# Altium project MU-RK3576J-MB.PrjPCB (part 4 of 13)

## Sheet CPU.SchDoc
size 420 x 297 mm; SheetNumber: 9; SheetTotal: 32; DocumentTypeShort: Э3; DocumentInvertoryNumber: ㅤ
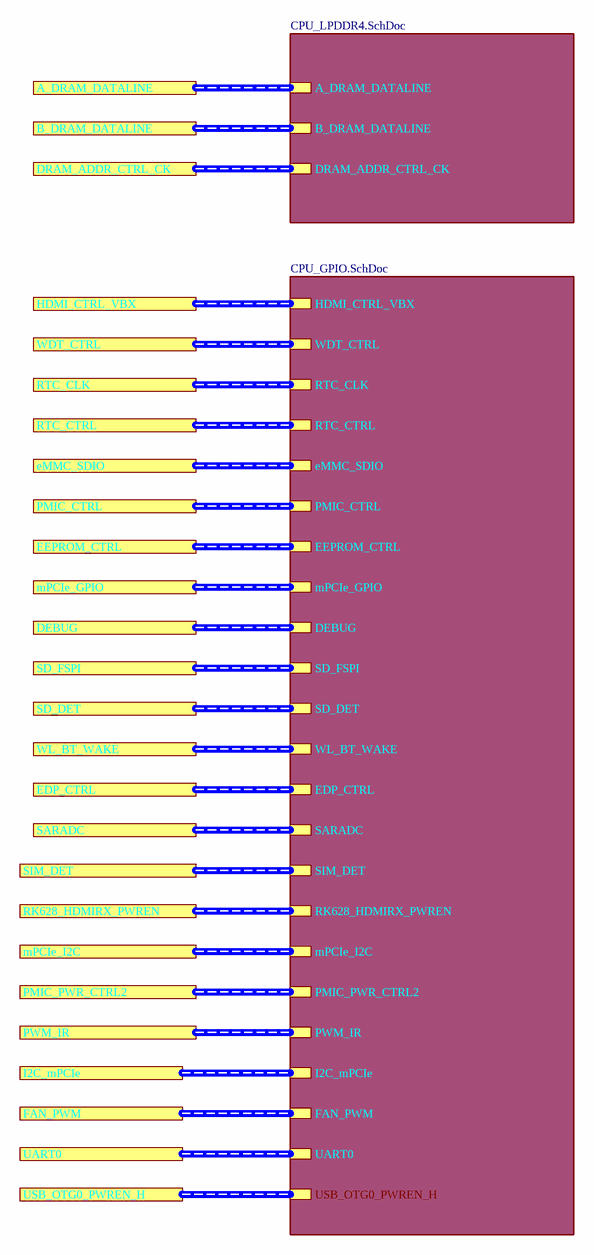
[diagram p8: CPU.SchDoc]

### Sub-sheets
CPU_GPIO = CPU_GPIO.SchDoc: HDMI_CTRL_VBX (harness HDMI_CTRL_VBX), WDT_CTRL (harness WDT_CTRL), RTC_CLK (harness RTC_CLK), RTC_CTRL (harness RTC_CTRL), eMMC_SDIO (harness eMMC_SDIO), PMIC_CTRL (harness PMIC_CTRL), EEPROM_CTRL (harness EEPROM_CTRL), SD_FSPI (harness SD_FSPI), SD_DET (harness SD_DET), WL_BT_WAKE (harness WL_BT_WAKE), EDP_CTRL (harness EDP_CTRL), SARADC (harness SARADC), mPCIe_GPIO (harness mPCIe_GPIO), SIM_DET (harness SIM_DET), mPCIe_I2C (harness mPCIe_I2C), RK628_HDMIRX_PWREN (harness RK628_HDMIRX_PWREN), PMIC_PWR_CTRL2 (harness PMIC_PWR_CTRL2), PWM_IR (harness PWM0_IR), I2C_mPCIe (harness I2C_mPCIe), DEBUG (harness DEBUG), FAN_PWM (harness FAN_PWM), UART0 (harness UART0), USB_OTG0_PWREN_H (harness USB_OTG0_PWREN_H)
CPU_LPDDR4 = CPU_LPDDR4.SchDoc: A_DRAM_DATALINE (harness A_DRAM_DATALINE), B_DRAM_DATALINE (harness B_DRAM_DATALINE), DRAM_ADDR_CTRL_CK (harness DRAM_ADDR_CTRL_CK)

### Ports
A_DRAM_DATALINE, B_DRAM_DATALINE, DEBUG, DRAM_ADDR_CTRL_CK, EDP_CTRL, EEPROM_CTRL, eMMC_SDIO, FAN_PWM, HDMI_CTRL_VBX, I2C_mPCIe, mPCIe_GPIO, mPCIe_I2C, PMIC_CTRL, PMIC_PWR_CTRL2, PWM_IR, RK628_HDMIRX_PWREN, RTC_CLK, RTC_CTRL, SARADC, SD_DET, SD_FSPI, SIM_DET, UART0, USB_OTG0_PWREN_H, WDT_CTRL, WL_BT_WAKE

### Buses and harness runs
harness port A_DRAM_DATALINE = sheet CPU_LPDDR4/A_DRAM_DATALINE
harness port B_DRAM_DATALINE = sheet CPU_LPDDR4/B_DRAM_DATALINE
harness port DEBUG = sheet CPU_GPIO/DEBUG
harness port DRAM_ADDR_CTRL_CK = sheet CPU_LPDDR4/DRAM_ADDR_CTRL_CK
harness port EDP_CTRL = sheet CPU_GPIO/EDP_CTRL
harness port EEPROM_CTRL = sheet CPU_GPIO/EEPROM_CTRL
harness port eMMC_SDIO = sheet CPU_GPIO/eMMC_SDIO
harness port FAN_PWM = sheet CPU_GPIO/FAN_PWM
harness port HDMI_CTRL_VBX = sheet CPU_GPIO/HDMI_CTRL_VBX
harness port I2C_mPCIe = sheet CPU_GPIO/I2C_mPCIe
harness port mPCIe_GPIO = sheet CPU_GPIO/mPCIe_GPIO
harness port mPCIe_I2C = sheet CPU_GPIO/mPCIe_I2C
harness port PMIC_CTRL = sheet CPU_GPIO/PMIC_CTRL
harness port PMIC_PWR_CTRL2 = sheet CPU_GPIO/PMIC_PWR_CTRL2
harness port PWM_IR = sheet CPU_GPIO/PWM_IR
harness port RK628_HDMIRX_PWREN = sheet CPU_GPIO/RK628_HDMIRX_PWREN
harness port RTC_CLK = sheet CPU_GPIO/RTC_CLK
harness port RTC_CTRL = sheet CPU_GPIO/RTC_CTRL
harness port SARADC = sheet CPU_GPIO/SARADC
harness port SD_DET = sheet CPU_GPIO/SD_DET
harness port SD_FSPI = sheet CPU_GPIO/SD_FSPI
harness port SIM_DET = sheet CPU_GPIO/SIM_DET
harness port UART0 = sheet CPU_GPIO/UART0
harness port USB_OTG0_PWREN_H = sheet CPU_GPIO/USB_OTG0_PWREN_H
harness port WDT_CTRL = sheet CPU_GPIO/WDT_CTRL
harness port WL_BT_WAKE = sheet CPU_GPIO/WL_BT_WAKE

### Notes on the sheet
- Подп. и дата
- Инв. № дубл.
- Взам. инв. №
- Инв. № подл.
- Изм.
- Лист
- № докум.
- Подп.
- Дата
- Копировал
- Формат А3

## Sheet CPU_LPDDR4.SchDoc
size 420 x 297 mm; Title1str: Модуль; Title2str: ATB-LW-USB-GateWay; Mass: ---; Letter1Column: О; Letter2Column: {L}; DocumentType1str: {Документ}; DocumentType2str: {Документ}; SpravNomer: {Справ. №}; PageSetup: Record=PageOptions|CenterHorizontal=False|CenterVertical=False|PrintScale=0.95|XCorrection=0.00|YCorrection=0.00|PrintKind=1|BorderSize=5000000|LeftOffset=0|BottomOffset=0|Orientation=1|PaperLength=1000|PaperWidth=1000|Scale=100|PaperSource=15|PrintQuality=600|MediaType=1|DitherType=10|PaperKind=A4|PrintScaleMode=1; Scale: 1:1; DocumentType: Схема электрическая принципиальная; SheetNumber: 10; SheetTotal: 32; DocumentTypeShort: Э3; DocumentInvertoryNumber: ㅤ
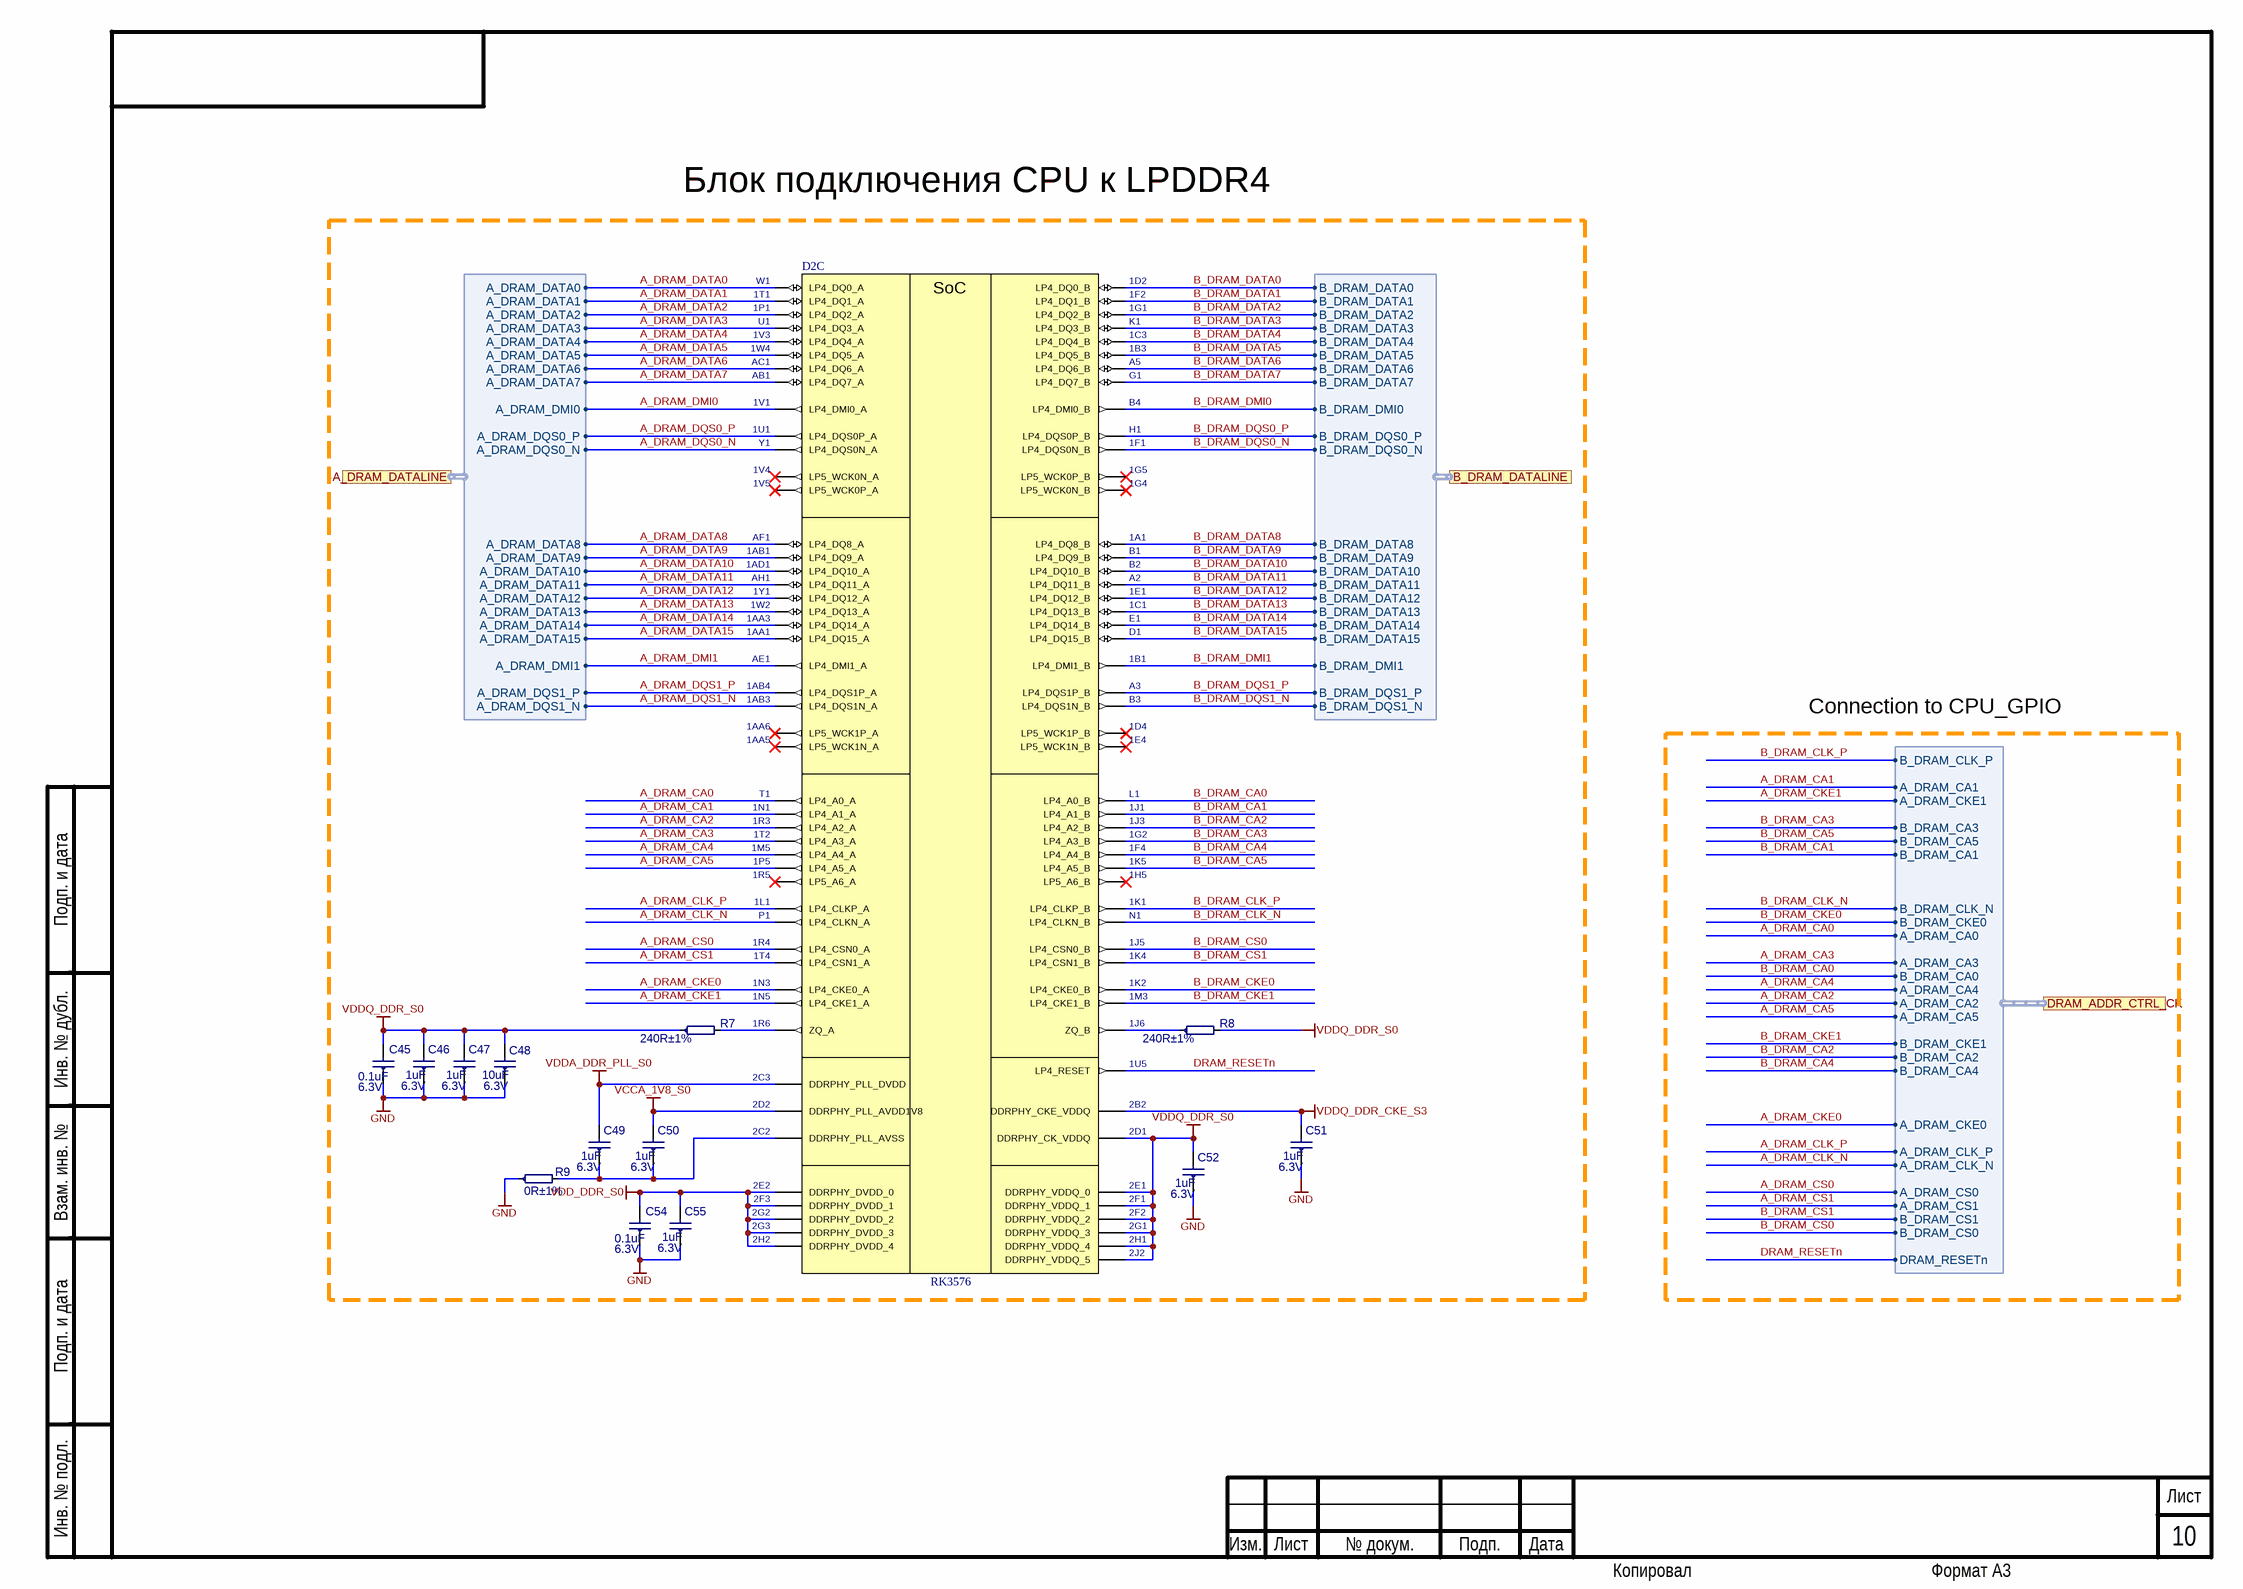
[diagram p9: CPU_LPDDR4.SchDoc]

### Parts
C45  0.1uF  Voltage: 6.3V  [C0201]
C46  1uF  Voltage: 6.3V  [C0201]
C47  1uF  Voltage: 6.3V  [C0201]
C48  10uF  Voltage: 6.3V  [C0402]
C49  1uF  Voltage: 6.3V  [C0201]
C50  1uF  Voltage: 6.3V  [C0201]
C51  1uF  Voltage: 6.3V  [C0201]
C52  1uF  Voltage: 6.3V  [C0201]
C54  0.1uF  Voltage: 6.3V  [C0201]
C55  1uF  Voltage: 6.3V  [C0201]
D2  RK3576  [BGAFCCSP698L]  (part C of 7)
R7  240R±1%  [R0201]
R8  240R±1%  [R0201]
R9  0R±1%  [R0402]

### Ports
A_DRAM_DATALINE (harness A_DRAM_DATALINE), B_DRAM_DATALINE (harness B_DRAM_DATALINE), DRAM_ADDR_CTRL_CK (harness DRAM_ADDR_CTRL_CK)

### Harnesses
A_DRAM_DATALINE: A_DRAM_DATA0, A_DRAM_DATA1, A_DRAM_DATA2, A_DRAM_DATA3, A_DRAM_DATA4, A_DRAM_DATA5, A_DRAM_DATA6, A_DRAM_DATA7, A_DRAM_DATA8, A_DRAM_DATA9, A_DRAM_DATA10, A_DRAM_DATA11, A_DRAM_DATA12, A_DRAM_DATA13, A_DRAM_DATA15, A_DRAM_DATA14, A_DRAM_DMI0, A_DRAM_DMI1, A_DRAM_DQS0_P, A_DRAM_DQS0_N, A_DRAM_DQS1_P, A_DRAM_DQS1_N
B_DRAM_DATALINE: B_DRAM_DATA0, B_DRAM_DATA1, B_DRAM_DATA2, B_DRAM_DATA3, B_DRAM_DATA4, B_DRAM_DATA5, B_DRAM_DATA6, B_DRAM_DATA7, B_DRAM_DATA9, B_DRAM_DATA10, B_DRAM_DATA11, B_DRAM_DATA12, B_DRAM_DATA13, B_DRAM_DATA15, B_DRAM_DATA14, B_DRAM_DMI1, B_DRAM_DMI0, B_DRAM_DQS0_P, B_DRAM_DQS0_N, B_DRAM_DQS1_N, B_DRAM_DQS1_P, B_DRAM_DATA8
DRAM_ADDR_CTRL_CK: A_DRAM_CA5, B_DRAM_CKE1, B_DRAM_CA2, A_DRAM_CLK_P, B_DRAM_CLK_N, A_DRAM_CA3, A_DRAM_CKE0, B_DRAM_CA0, B_DRAM_CKE0, DRAM_RESETn, A_DRAM_CA4, B_DRAM_CA1, A_DRAM_CKE1, B_DRAM_CA3, B_DRAM_CLK_P, A_DRAM_CLK_N, B_DRAM_CA5, A_DRAM_CA0, A_DRAM_CA1, A_DRAM_CA2, B_DRAM_CA4, A_DRAM_CS0, A_DRAM_CS1, B_DRAM_CS1, B_DRAM_CS0

### Nets
GND: C45.1 C46.1 C47.1 C48.1 C51.1 C52.1 C54.1 C55.1 R9.1
VCCA_1V8_S0: C50.2 D2.2D2(DDRPHY_PLL_AVDD1V8)
VDD_DDR_S0: C54.2 C55.2 D2.2E2(DDRPHY_DVDD_0) D2.2F3(DDRPHY_DVDD_1) D2.2G2(DDRPHY_DVDD_2) D2.2G3(DDRPHY_DVDD_3) D2.2H2(DDRPHY_DVDD_4)
VDDA_DDR_PLL_S0: C49.2 D2.2C3(DDRPHY_PLL_DVDD)
VDDQ_DDR_CKE_S3: C51.2 D2.2B2(DDRPHY_CKE_VDDQ)
VDDQ_DDR_S0: C45.2 C46.2 C47.2 C48.2 C52.2 D2.2D1(DDRPHY_CK_VDDQ) D2.2E1(DDRPHY_VDDQ_0) D2.2F1(DDRPHY_VDDQ_1) D2.2F2(DDRPHY_VDDQ_2) D2.2G1(DDRPHY_VDDQ_3) D2.2H1(DDRPHY_VDDQ_4) D2.2J2(DDRPHY_VDDQ_5) R7.1 R8.2
A_DRAM_CA0: D2.T1(LP4_A0_A) ; port DRAM_ADDR_CTRL_CK.A_DRAM_CA0
A_DRAM_CA1: D2.1N1(LP4_A1_A) ; port DRAM_ADDR_CTRL_CK.A_DRAM_CA1
A_DRAM_CA2: D2.1R3(LP4_A2_A) ; port DRAM_ADDR_CTRL_CK.A_DRAM_CA2
A_DRAM_CA3: D2.1T2(LP4_A3_A) ; port DRAM_ADDR_CTRL_CK.A_DRAM_CA3
A_DRAM_CA4: D2.1M5(LP4_A4_A) ; port DRAM_ADDR_CTRL_CK.A_DRAM_CA4
A_DRAM_CA5: D2.1P5(LP4_A5_A) ; port DRAM_ADDR_CTRL_CK.A_DRAM_CA5
A_DRAM_CKE0: D2.1N3(LP4_CKE0_A) ; port DRAM_ADDR_CTRL_CK.A_DRAM_CKE0
A_DRAM_CKE1: D2.1N5(LP4_CKE1_A) ; port DRAM_ADDR_CTRL_CK.A_DRAM_CKE1
A_DRAM_CLK_N: D2.P1(LP4_CLKN_A) ; port DRAM_ADDR_CTRL_CK.A_DRAM_CLK_N
A_DRAM_CLK_P: D2.1L1(LP4_CLKP_A) ; port DRAM_ADDR_CTRL_CK.A_DRAM_CLK_P
A_DRAM_CS0: D2.1R4(LP4_CSN0_A) ; port DRAM_ADDR_CTRL_CK.A_DRAM_CS0
A_DRAM_CS1: D2.1T4(LP4_CSN1_A) ; port DRAM_ADDR_CTRL_CK.A_DRAM_CS1
A_DRAM_DATA0: D2.W1(LP4_DQ0_A) ; port A_DRAM_DATALINE.A_DRAM_DATA0
A_DRAM_DATA1: D2.1T1(LP4_DQ1_A) ; port A_DRAM_DATALINE.A_DRAM_DATA1
A_DRAM_DATA2: D2.1P1(LP4_DQ2_A) ; port A_DRAM_DATALINE.A_DRAM_DATA2
A_DRAM_DATA3: D2.U1(LP4_DQ3_A) ; port A_DRAM_DATALINE.A_DRAM_DATA3
A_DRAM_DATA4: D2.1V3(LP4_DQ4_A) ; port A_DRAM_DATALINE.A_DRAM_DATA4
A_DRAM_DATA5: D2.1W4(LP4_DQ5_A) ; port A_DRAM_DATALINE.A_DRAM_DATA5
A_DRAM_DATA6: D2.AC1(LP4_DQ6_A) ; port A_DRAM_DATALINE.A_DRAM_DATA6
A_DRAM_DATA7: D2.AB1(LP4_DQ7_A) ; port A_DRAM_DATALINE.A_DRAM_DATA7
A_DRAM_DATA8: D2.AF1(LP4_DQ8_A) ; port A_DRAM_DATALINE.A_DRAM_DATA8
A_DRAM_DATA9: D2.1AB1(LP4_DQ9_A) ; port A_DRAM_DATALINE.A_DRAM_DATA9
A_DRAM_DATA10: D2.1AD1(LP4_DQ10_A) ; port A_DRAM_DATALINE.A_DRAM_DATA10
A_DRAM_DATA11: D2.AH1(LP4_DQ11_A) ; port A_DRAM_DATALINE.A_DRAM_DATA11
A_DRAM_DATA12: D2.1Y1(LP4_DQ12_A) ; port A_DRAM_DATALINE.A_DRAM_DATA12
A_DRAM_DATA13: D2.1W2(LP4_DQ13_A) ; port A_DRAM_DATALINE.A_DRAM_DATA13
A_DRAM_DATA14: D2.1AA3(LP4_DQ14_A) ; port A_DRAM_DATALINE.A_DRAM_DATA14
A_DRAM_DATA15: D2.1AA1(LP4_DQ15_A) ; port A_DRAM_DATALINE.A_DRAM_DATA15
A_DRAM_DMI0: D2.1V1(LP4_DMI0_A) ; port A_DRAM_DATALINE.A_DRAM_DMI0  [project net A_DRAM_DATALINE.A_DRAM_DMI0]
A_DRAM_DMI1: D2.AE1(LP4_DMI1_A) ; port A_DRAM_DATALINE.A_DRAM_DMI1  [project net A_DRAM_DATALINE.A_DRAM_DMI1]
A_DRAM_DQS0_N: D2.Y1(LP4_DQS0N_A) ; port A_DRAM_DATALINE.A_DRAM_DQS0_N  [project net A_DRAM_DATALINE.A_DRAM_DQS0_N]
A_DRAM_DQS0_P: D2.1U1(LP4_DQS0P_A) ; port A_DRAM_DATALINE.A_DRAM_DQS0_P  [project net A_DRAM_DATALINE.A_DRAM_DQS0_P]
A_DRAM_DQS1_N: D2.1AB3(LP4_DQS1N_A) ; port A_DRAM_DATALINE.A_DRAM_DQS1_N  [project net A_DRAM_DATALINE.A_DRAM_DQS1_N]
A_DRAM_DQS1_P: D2.1AB4(LP4_DQS1P_A) ; port A_DRAM_DATALINE.A_DRAM_DQS1_P  [project net A_DRAM_DATALINE.A_DRAM_DQS1_P]
B_DRAM_CA0: D2.L1(LP4_A0_B) ; port DRAM_ADDR_CTRL_CK.B_DRAM_CA0
B_DRAM_CA1: D2.1J1(LP4_A1_B) ; port DRAM_ADDR_CTRL_CK.B_DRAM_CA1
B_DRAM_CA2: D2.1J3(LP4_A2_B) ; port DRAM_ADDR_CTRL_CK.B_DRAM_CA2
B_DRAM_CA3: D2.1G2(LP4_A3_B) ; port DRAM_ADDR_CTRL_CK.B_DRAM_CA3
B_DRAM_CA4: D2.1F4(LP4_A4_B) ; port DRAM_ADDR_CTRL_CK.B_DRAM_CA4
B_DRAM_CA5: D2.1K5(LP4_A5_B) ; port DRAM_ADDR_CTRL_CK.B_DRAM_CA5
B_DRAM_CKE0: D2.1K2(LP4_CKE0_B) ; port DRAM_ADDR_CTRL_CK.B_DRAM_CKE0
B_DRAM_CKE1: D2.1M3(LP4_CKE1_B) ; port DRAM_ADDR_CTRL_CK.B_DRAM_CKE1
B_DRAM_CLK_N: D2.N1(LP4_CLKN_B) ; port DRAM_ADDR_CTRL_CK.B_DRAM_CLK_N
B_DRAM_CLK_P: D2.1K1(LP4_CLKP_B) ; port DRAM_ADDR_CTRL_CK.B_DRAM_CLK_P
B_DRAM_CS0: D2.1J5(LP4_CSN0_B) ; port DRAM_ADDR_CTRL_CK.B_DRAM_CS0
B_DRAM_CS1: D2.1K4(LP4_CSN1_B) ; port DRAM_ADDR_CTRL_CK.B_DRAM_CS1
B_DRAM_DATA0: D2.1D2(LP4_DQ0_B) ; port B_DRAM_DATALINE.B_DRAM_DATA0
B_DRAM_DATA1: D2.1F2(LP4_DQ1_B) ; port B_DRAM_DATALINE.B_DRAM_DATA1
B_DRAM_DATA2: D2.1G1(LP4_DQ2_B) ; port B_DRAM_DATALINE.B_DRAM_DATA2
B_DRAM_DATA3: D2.K1(LP4_DQ3_B) ; port B_DRAM_DATALINE.B_DRAM_DATA3
B_DRAM_DATA4: D2.1C3(LP4_DQ4_B) ; port B_DRAM_DATALINE.B_DRAM_DATA4
B_DRAM_DATA5: D2.1B3(LP4_DQ5_B) ; port B_DRAM_DATALINE.B_DRAM_DATA5
B_DRAM_DATA6: D2.A5(LP4_DQ6_B) ; port B_DRAM_DATALINE.B_DRAM_DATA6
B_DRAM_DATA7: D2.G1(LP4_DQ7_B) ; port B_DRAM_DATALINE.B_DRAM_DATA7
B_DRAM_DATA8: D2.1A1(LP4_DQ8_B) ; port B_DRAM_DATALINE.B_DRAM_DATA8
B_DRAM_DATA9: D2.B1(LP4_DQ9_B) ; port B_DRAM_DATALINE.B_DRAM_DATA9
B_DRAM_DATA10: D2.B2(LP4_DQ10_B) ; port B_DRAM_DATALINE.B_DRAM_DATA10
B_DRAM_DATA11: D2.A2(LP4_DQ11_B) ; port B_DRAM_DATALINE.B_DRAM_DATA11
B_DRAM_DATA12: D2.1E1(LP4_DQ12_B) ; port B_DRAM_DATALINE.B_DRAM_DATA12
B_DRAM_DATA13: D2.1C1(LP4_DQ13_B) ; port B_DRAM_DATALINE.B_DRAM_DATA13
B_DRAM_DATA14: D2.E1(LP4_DQ14_B) ; port B_DRAM_DATALINE.B_DRAM_DATA14
B_DRAM_DATA15: D2.D1(LP4_DQ15_B) ; port B_DRAM_DATALINE.B_DRAM_DATA15
B_DRAM_DMI0: D2.B4(LP4_DMI0_B) ; port B_DRAM_DATALINE.B_DRAM_DMI0  [project net B_DRAM_DATALINE.B_DRAM_DMI0]
B_DRAM_DMI1: D2.1B1(LP4_DMI1_B) ; port B_DRAM_DATALINE.B_DRAM_DMI1  [project net B_DRAM_DATALINE.B_DRAM_DMI1]
B_DRAM_DQS0_N: D2.1F1(LP4_DQS0N_B) ; port B_DRAM_DATALINE.B_DRAM_DQS0_N  [project net B_DRAM_DATALINE.B_DRAM_DQS0_N]
B_DRAM_DQS0_P: D2.H1(LP4_DQS0P_B) ; port B_DRAM_DATALINE.B_DRAM_DQS0_P  [project net B_DRAM_DATALINE.B_DRAM_DQS0_P]
B_DRAM_DQS1_N: D2.B3(LP4_DQS1N_B) ; port B_DRAM_DATALINE.B_DRAM_DQS1_N  [project net B_DRAM_DATALINE.B_DRAM_DQS1_N]
B_DRAM_DQS1_P: D2.A3(LP4_DQS1P_B) ; port B_DRAM_DATALINE.B_DRAM_DQS1_P  [project net B_DRAM_DATALINE.B_DRAM_DQS1_P]
DRAM_RESETn: D2.1U5(LP4_RESET) ; port DRAM_ADDR_CTRL_CK.DRAM_RESETn  [project net DRAM_ADDR_CTRL_CK.DRAM_RESETn]
NetC49_1: C49.1 C50.1 D2.2C2(DDRPHY_PLL_AVSS) R9.2
NetD2_1J6: D2.1J6(ZQ_B) R8.1
NetD2_1R6: D2.1R6(ZQ_A) R7.2

Not connected (* = marked no-connect by the designer): D2 1AA5(LP5_WCK1N_A)* 1AA6(LP5_WCK1P_A)* 1D4(LP5_WCK1P_B)* 1E4(LP5_WCK1N_B)* 1G4(LP5_WCK0N_B)* 1G5(LP5_WCK0P_B)* 1H5(LP5_A6_B)* 1R5(LP5_A6_A)* 1V4(LP5_WCK0N_A)* 1V5(LP5_WCK0P_A)*

### Notes on the sheet
- Блок подключения CPU к LPDDR4
- Connection to CPU_GPIO
- Подп. и дата
- Инв. № дубл.
- Взам. инв. №
- Инв. № подл.
- Изм.
- Лист
- № докум.
- Подп.
- Дата
- Копировал
- Формат А3
- (in symbol RK3576, part C) SoC

### Library data of the parts
C45 C54 = 0201-X5R-6.3V-0.1uF±10%: as C124 on sheet PWR_CPU; Case: C0201; Part Number: 0201-X5R-6.3V-0.1uF±10%; Value: 0.1uF; Temperature: -55°C~85°C; ComponentLink2Description: Link to datasheet; ComponentLink1Description: DATASHEET; ComponentLink2URL: https://www.terraelectronica.ru/product/1020032; ComponentLink1URL: Datasheets/capacitors/UPY-GPHC_X5R_4V-to-50V_27.pdf; Last changed: 27.10.2022
C46 C47 C49-C52 C55 = 0201-X5R-6.3V-1uF±20%: as C127-C129 on sheet PWR_CPU; Case: C0201; Part Number: 0201-X5R-6.3V-1uF±20%; Value: 1uF; Temperature: -55°C~85°C; ComponentLink2Description: Link to datasheet; ComponentLink1Description: DATASHEET; ComponentLink2URL: https://www.terraelectronica.ru/product/1209278; ComponentLink1URL: Datasheets/capacitors/GRM033R60J105MEA2-61A.pdf; Last changed: 27.10.2022
C48 = 0402-X5R-6.3V-10uF±20%: as C130 on sheet PWR_CPU; Case: C0402; Part Number: 0402-X5R-6.3V-10uF±20%; Value: 10uF; Temperature: -55°C~125°C; ComponentLink2Description: Link to datasheet; ComponentLink1Description: DATASHEET; ComponentLink2URL: https://ru.mouser.com/ProductDetail/YAGEO/CC0402MRX5R5BB106?qs=%2Fha2pyFadujQAk9rG2cgJj8l7IbODD3KVaDjvxAcKzu9LtlLnRlq6Q%3D%3D; ComponentLink1URL: Datasheets/capacitors/UPY-GPHC_X5R_4V-to-50V_27.pdf; Last changed: 27.10.2022
D2 = RK3576: as D2 on sheet PWR_CPU; Part Number: RK3576; Temperature: -40°C~85°C; Value: RK3576; ComponentLink1Description: DATASHEET; NameFromManufacturer: RK3576; ComponentLink1URL: https://wiki.friendlyelec.com/wiki/images/b/bf/Rockchip_RK3576_Datasheet_V1.5-20241216.pdf; Last changed: 06.01.2026
R7 R8 = 0201-0.05W-0R-100ppm-5%: *; Part Number: 0201-0.05W-240R-100ppm-5%; NameFromManufacturer: RC0201FR-07240RL; Manufacturer: Yageo; Place: *); Value: 240R; Tolerance: 1%; Check: False; Case: R0201; Temperature: -40°C~125°C; ComponentLink1Description: DATASHEET; ComponentLink1URL: https://www.digikey.com/en/products/detail/yageo/RC0201JR-070RL/1948898; Datasheet: Datasheets/resistors/PYu-RC_Group_51_RoHS_L_11.pdf+BB3:B271; Last changed: 27.10.2022
R9 = 0402-0.0625W-0R-100ppm±1%: as R29 on sheet PWR_CPU; Case: R0402; Part Number: 0402-0.0625W-0R-100ppm±1%; Tolerance: 1%; Temperature: -55°C~155°C; ComponentLink1Description: DATASHEET; ComponentLink1URL: https://www.chipdip.ru/product0/8000617426?ysclid=l7og5x0plo427794326; Datasheet: Datasheets/resistors/DOC012445956.pdf; Last changed: 27.10.2022